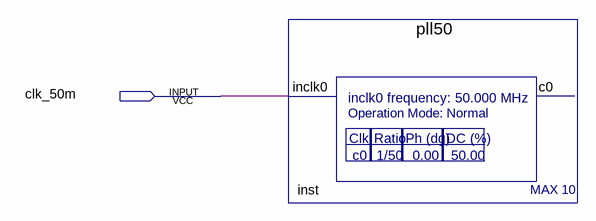
[diagram p0: schematic sheet]
// Quartus schematic UltraSonic.bdf as structural Verilog: 1 symbols, 1 pins
module UltraSonic (
  input  clk_50m
);

  pll50 inst (.inclk0(clk_50m));  // open: c0
endmodule
